# Altium schematic sheet SafeBox.SchDoc
size 381 x 241 mm
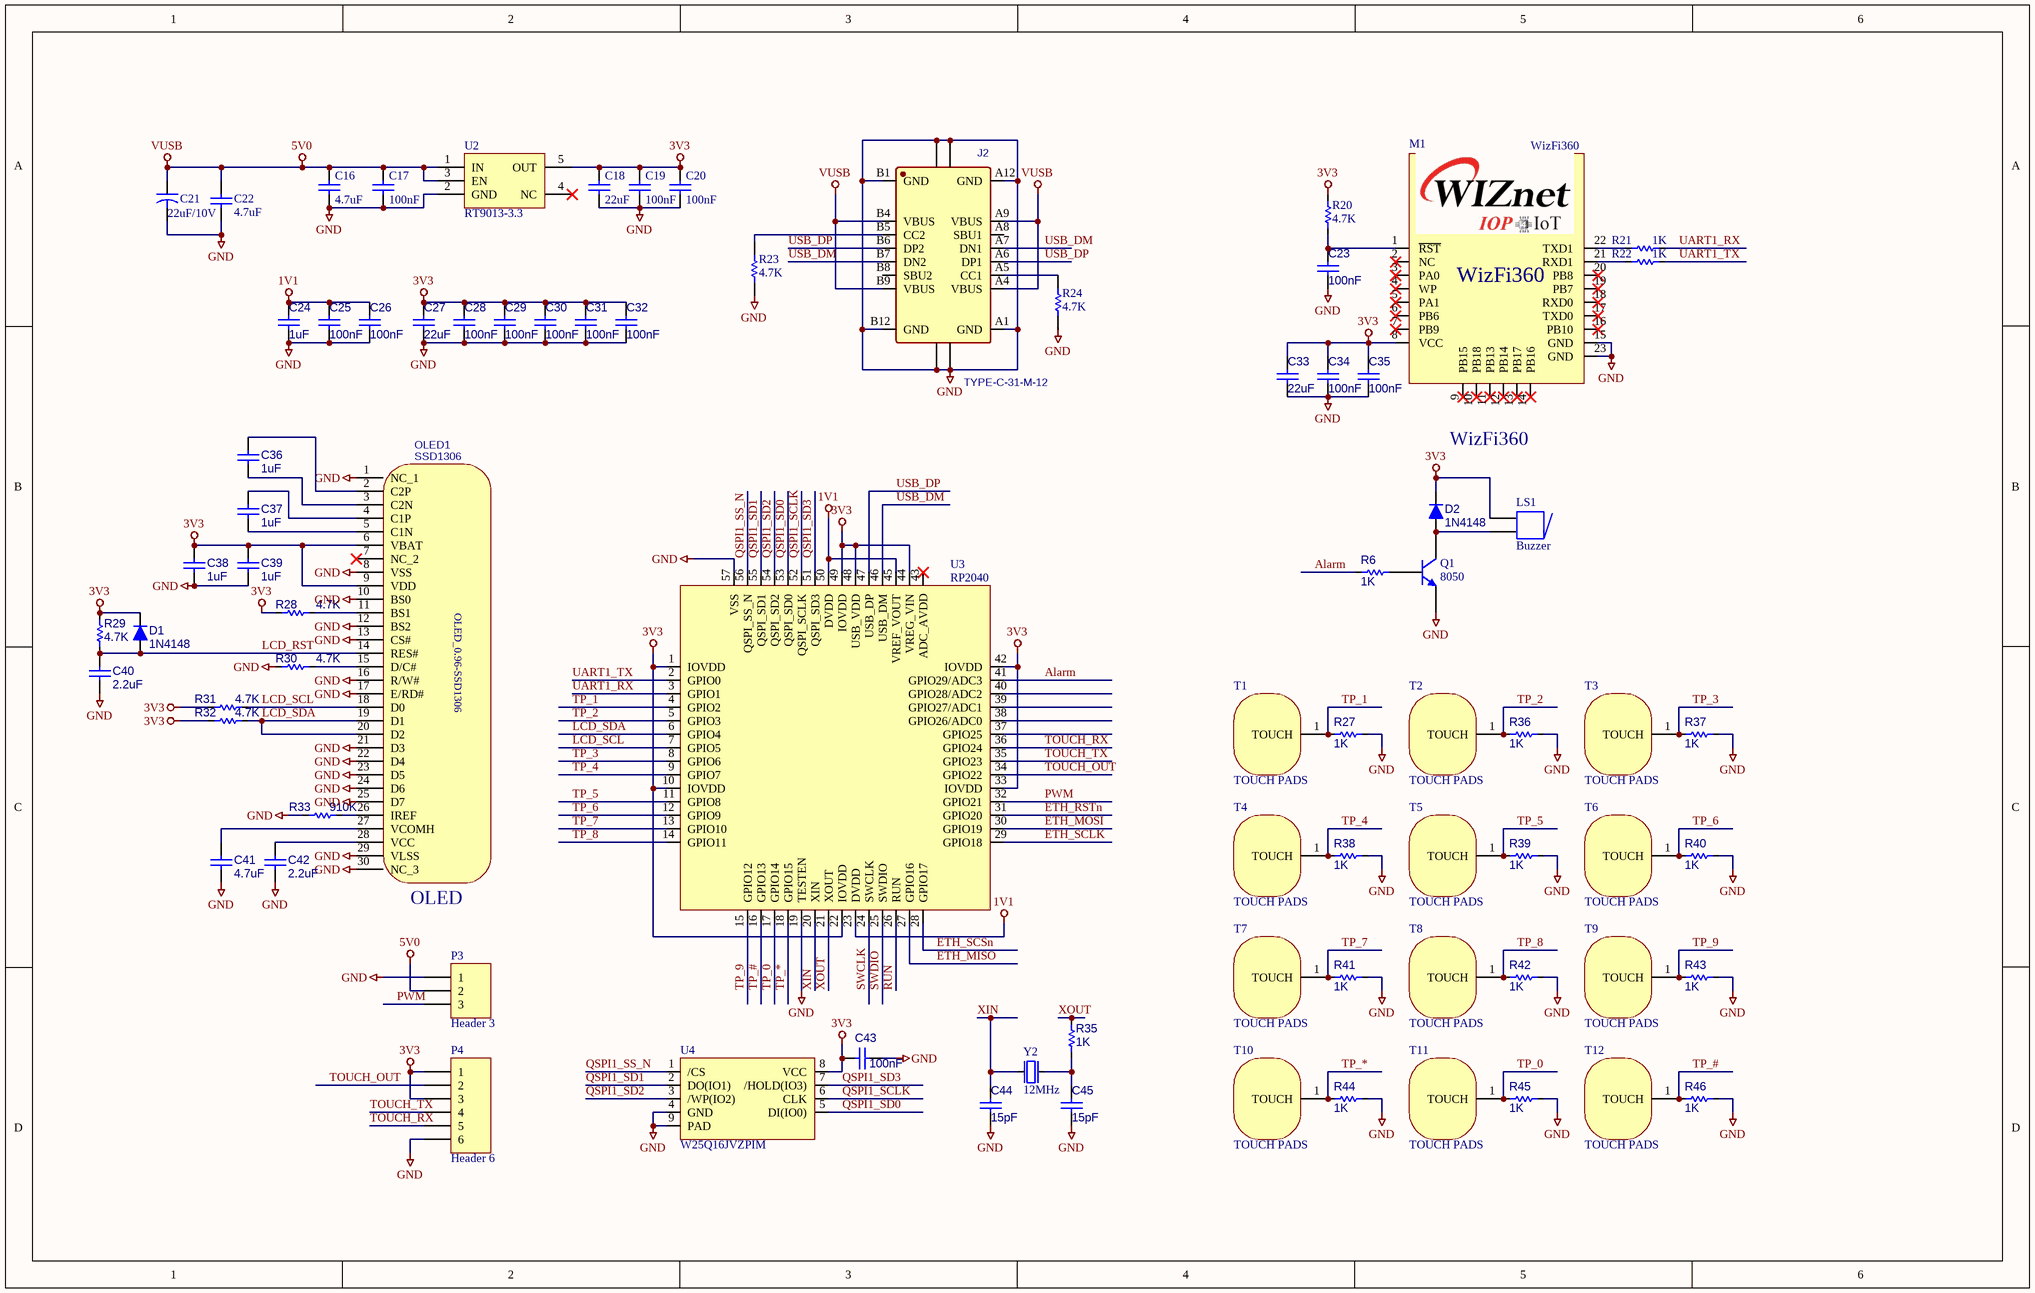
[diagram p0: SafeBox.SchDoc]

## Parts
C16  value 4.7uF  [0603-C]  (hidden comment: Cap)
C17  value 100nF  [0603-C]  (hidden comment: Cap)
C18  value 22uF  [0603-C]  (hidden comment: Cap)
C19  value 100nF  [0603-C]  (hidden comment: Cap)
C20  value 100nF  [0603-C]  (hidden comment: Cap)
C21  value 22uF/10V  [1206-C]  (hidden comment: Cap2)
C22  value 4.7uF  [1206-c]  (hidden comment: Cap)
C23  100nF  [0603-C]
C24  1uF  [0603-C]
C25  100nF  [0603-C]
C26  100nF  [0603-C]
C27  22uF  [0603-C]
C28  100nF  [0603-C]
C29  100nF  [0603-C]
C30  100nF  [0603-C]
C31  100nF  [0603-C]
C32  100nF  [0603-C]
C33  22uF  [0603-C]
C34  100nF  [0603-C]
C35  100nF  [0603-C]
C36  1uF  [0603-C]
C37  1uF  [0603-C]
C38  1uF  [0603-C]
C39  1uF  [0603-C]
C40  2.2uF  [0603-C]
C41  4.7uF  [0603-C]
C42  2.2uF  [0603-C]
C43  100nF  [0603-C]
C44  15pF  [0603-C]
C45  15pF  [0603-C]
D1  1N4148  [SOD-323(1-C,2-A)]
D2  1N4148  [SOD-323(1-C,2-A)]
J2  TYPE-C-31-M-12  [USB-C_SMT-TYPE-C-31-M-12]
LS1  Buzzer  [Buzzer 5020 SMT]
M1  WizFi360  [WIZFI360-PA]
OLED1  SSD1306  [OLED1.3_SSD1306]
P3  Header 3  [HDR1X3]
P4  Header 6  [HDR1X6]
Q1  8050  [SOT-23-3]
R6  1K  [0603-R]
R20  4.7K  [0603-C]
R21  1K  [0603-C]
R22  1K  [0603-C]
R23  value 4.7K  [0603-R]  (hidden comment: Res1)
R24  value 4.7K  [0603-R]  (hidden comment: Res1)
R27  1K  [0603-R]
R28  4.7K  [0603-R]
R29  4.7K  [0603-R]
R30  4.7K  [0603-R]
R31  4.7K  [0603-R]
R32  4.7K  [0603-R]
R33  910K  [0603-R]
R35  1K  [0603-R]
R36  1K  [0603-R]
R37  1K  [0603-R]
R38  1K  [0603-R]
R39  1K  [0603-R]
R40  1K  [0603-R]
R41  1K  [0603-R]
R42  1K  [0603-R]
R43  1K  [0603-R]
R44  1K  [0603-R]
R45  1K  [0603-R]
R46  1K  [0603-R]
T1  TOUCH PADS  [Touch PADS]
T2  TOUCH PADS  [Touch PADS]
T3  TOUCH PADS  [Touch PADS]
T4  TOUCH PADS  [Touch PADS]
T5  TOUCH PADS  [Touch PADS]
T6  TOUCH PADS  [Touch PADS]
T7  TOUCH PADS  [Touch PADS]
T8  TOUCH PADS  [Touch PADS]
T9  TOUCH PADS  [Touch PADS]
T10  TOUCH PADS  [Touch PADS]
T11  TOUCH PADS  [Touch PADS]
T12  TOUCH PADS  [Touch PADS]
U2  RT9013-3.3  [SOT-23-5]
U3  RP2040  [QFN56(0.4/7X7)]
U4  W25Q16JVZPIM  [WSON8(6X5_1.27)]
Y2  12MHz  [OSC-TZ1067B]

## Nets
1V1: C24.2 C25.2 C26.2 U3.23(DVDD) U3.45(VREF_VOUT) U3.50(DVDD)
3V3: C18.2 C19.2 C20.2 C27.2 C28.2 C29.2 C30.2 C31.2 C32.2 C33.2 C34.2 C35.2 C38.1 C39.1 C43.2 D1.1(K) D2.1(K) LS1.2 M1.8(VCC) OLED1.6(VBAT) OLED1.9(VDD) P4.1 P4.3 R20.2 R28.1 R29.2 R31.1 R32.1 U2.5(OUT) U3.1(IOVDD) U3.10(IOVDD) U3.22(IOVDD) U3.33(IOVDD) U3.42(IOVDD) U3.44(VREG_VIN) U3.48(USB_VDD) U3.49(IOVDD) U4.8(VCC)
5V0: C16.2 C17.2 C21.1 C22.1 J2.A4(VBUS) J2.A9(VBUS) J2.B4(VBUS) J2.B9(VBUS) P3.2 U2.1(IN) U2.3(EN)  [also labelled VUSB]
GND: C16.1 C17.1 C18.1 C19.1 C20.1 C21.2 C22.2 C23.1 C24.1 C25.1 C26.1 C27.1 C28.1 C29.1 C30.1 C31.1 C32.1 C33.1 C34.1 C35.1 C38.2 C39.2 C40.2 C41.2 C42.2 C43.1 C44.2 C45.2 J2.1 J2.2 J2.3 J2.4 J2.A1(GND) J2.A12(GND) J2.B1(GND) J2.B12(GND) M1.15(GND) M1.23(GND) OLED1.1(NC_1) OLED1.8(VSS) OLED1.10(BS0) OLED1.12(BS2) OLED1.13(CS#) OLED1.16(R/W#) OLED1.17(E/RD#) OLED1.21(D3) OLED1.22(D4) OLED1.23(D5) OLED1.24(D6) OLED1.25(D7) OLED1.29(VLSS) OLED1.30(NC_3) P3.1 P4.6 Q1.2(E) R23.1 R24.1 R27.1 R30.2 R33.1 R36.1 R37.1 R38.1 R39.1 R40.1 R41.1 R42.1 R43.1 R44.1 R45.1 R46.1 U2.2(GND) U3.19(TESTEN) U3.57(VSS) U4.4(GND) U4.9(PAD) Y2.2 Y2.4
Alarm: R6.2 U3.41(GPIO29/ADC3)
ETH_MISO: U3.27(GPIO16)
ETH_MOSI: U3.30(GPIO19)
ETH_RSTn: U3.31(GPIO20)
ETH_SCLK: U3.29(GPIO18)
ETH_SCSn: U3.28(GPIO17)
LCD_RST: C40.1 D1.2(A) OLED1.14(RES#) R29.1
LCD_SCL: OLED1.18(D0) R31.2 U3.7(GPIO5)
LCD_SDA: OLED1.19(D1) OLED1.20(D2) R32.2 U3.6(GPIO4)
PWM: P3.3 U3.32(GPIO21)
QSPI1_SCLK: U3.52(QSPI_SCLK) U4.6(CLK)
QSPI1_SD0: U3.53(QSPI_SD0) U4.5(DI(IO0))
QSPI1_SD1: U3.55(QSPI_SD1) U4.2(DO(IO1))
QSPI1_SD2: U3.54(QSPI_SD2) U4.3(/WP(IO2))
QSPI1_SD3: U3.51(QSPI_SD3) U4.7(/HOLD(IO3))
QSPI1_SS_N: U3.56(QSPI_SS_N) U4.1(/CS)
RUN: U3.26(RUN)
SWCLK: U3.24(SWCLK)
SWDIO: U3.25(SWDIO)
TOUCH_OUT: P4.2 U3.34(GPIO22)
TOUCH_RX: P4.5 U3.36(GPIO24)
TOUCH_TX: P4.4 U3.35(GPIO23)
TP_0: R45.2 T11.1(TOUCH) U3.17(GPIO14)
TP_1: R27.2 T1.1(TOUCH) U3.4(GPIO2)
TP_2: R36.2 T2.1(TOUCH) U3.5(GPIO3)
TP_3: R37.2 T3.1(TOUCH) U3.8(GPIO6)
TP_4: R38.2 T4.1(TOUCH) U3.9(GPIO7)
TP_5: R39.2 T5.1(TOUCH) U3.11(GPIO8)
TP_6: R40.2 T6.1(TOUCH) U3.12(GPIO9)
TP_7: R41.2 T7.1(TOUCH) U3.13(GPIO10)
TP_8: R42.2 T8.1(TOUCH) U3.14(GPIO11)
TP_9: R43.2 T9.1(TOUCH) U3.15(GPIO12)
TP_#: R46.2 T12.1(TOUCH) U3.16(GPIO13)
TP_*: R44.2 T10.1(TOUCH) U3.18(GPIO15)
UART1_RX: R21.2 U3.3(GPIO1)
UART1_TX: R22.2 U3.2(GPIO0)
USB_DM: J2.A7(DN1) J2.B7(DN2) U3.46(USB_DM)
USB_DP: J2.A6(DP1) J2.B6(DP2) U3.47(USB_DP)
XIN: C44.1 U3.20(XIN) Y2.1(inp)
XOUT: R35.2 U3.21(XOUT)
NetC23_2: C23.2 M1.1(~{RST}) R20.1
NetC36_1: C36.1 OLED1.2(C2P)
NetC36_2: C36.2 OLED1.3(C2N)
NetC37_1: C37.1 OLED1.4(C1P)
NetC37_2: C37.2 OLED1.5(C1N)
NetC41_1: C41.1 OLED1.27(VCOMH)
NetC42_1: C42.1 OLED1.28(VCC)
NetC45_1: C45.1 R35.1 Y2.3(out)
NetD2_2: D2.2(A) LS1.1 Q1.3(C)
NetJ2_A5: J2.A5(CC1) R24.2
NetJ2_B5: J2.B5(CC2) R23.2
NetM1_21: M1.21(RXD1) R22.1
NetM1_22: M1.22(TXD1) R21.1
NetOLED1_11: OLED1.11(BS1) R28.2
NetOLED1_15: OLED1.15(D/C#) R30.1
NetOLED1_26: OLED1.26(IREF) R33.2
NetQ1_1: Q1.1(B) R6.1

Not connected (* = marked no-connect by the designer): J2 A8(SBU1) B8(SBU2); M1 2(NC)* 3(PA0)* 4(WP)* 5(PA1)* 6(PB6)* 7(PB9)* 9(PB15)* 10(PB18)* 11(PB13)* 12(PB14)* 13(PB17)* 14(PB16)* 16(PB10)* 17(TXD0)* 18(RXD0)* 19(PB7)* 20(PB8)*; OLED1 7(NC_2)*; U2 4(NC)*; U3 37(GPIO25) 38(GPIO26/ADC0) 39(GPIO27/ADC1) 40(GPIO28/ADC2) 43(ADC_AVDD)*

## Notes on the sheet
- WizFi360
- (near OLED1) OLED
- (in symbol SSD1306) OLED_0.96-SSD1306

## Library data of the parts
C16-C20 C22 = Cap: Capacitor; Published: 8-Jun-2000; LatestRevisionDate: 17-Jul-2002; LatestRevisionNote: Re-released for DXP Platform.; PackageReference: RAD-0.3; Publisher: Altium Limited
C21 = Cap2: Capacitor; Published: 23-Sep-2002; Publisher: Altium Limited
C23-C32 C34-C45 = CAP-0402: Ceramic CAP 0402(1005)
C33 = CAP-0805: Ceramic CAP 0805(2012)
D1 D2 = DIODE-BAT60A: Silicon Schottky Diode
J2 = TYPE-C-31-M-12: BOM_Manufacturer: Rectangular Connectors - Contacts; Contributor: LCSC; BOM_Supplier: LCSC; BOM_Supplier Part: C165948; BOM_Manufacturer Part: TYPE-C-31-M-12; spicePre: U; spiceSymbolName: TYPE-C-31-M-12
LS1 = Buzzer: Magnetic Transducer Buzzer; Published: 24-Mar-1999; LatestRevisionDate: 17-Dec-2003; LatestRevisionNote: Schematic revised, PCB Footprint replaced.; DatasheetVersion: 17-Dec-2003; PackageReference: ABSM-1574; Publisher: Altium Limited; PackageDescription: Magnetic Transducer Buzzer; ComponentLink1Description: Manufacturer Link; ComponentLink1URL: http://www.megastar.com/linecard/buzzmode/index.php
OLED1 = SSD1306: Contributor: xinghen; spicePre: U; spiceSymbolName: SSD1306
P3 = Header 3: Header, 3-Pin; LatestRevisionDate: 17-Jul-2002; LatestRevisionNote: Re-released for DXP Platform.; Publisher: Altium Limited
P4 = Header 6: Header, 6-Pin; LatestRevisionDate: 17-Jul-2002; LatestRevisionNote: Re-released for DXP Platform.; Publisher: Altium Limited
Q1 = NPN: NPN Bipolar Transistor; Published: 8-Jun-2000; LatestRevisionDate: 17-Jul-2002; LatestRevisionNote: Re-released for DXP Platform.; PackageReference: TO-226-AA; Publisher: Altium Limited; PackageDescription: TO, Flat Index; 3 In-Line, Axial Leads; Body Dia. 4.8mm; Leads 0.55 x 0.51 mm (max); Code_JEDEC: TO-226-AA
R6 R27-R33 R35-R46 = RES-0402: 0603-R
R20-R22 = RES-0402
R23 R24 = Res1: Resistor; Published: 8-Jun-2000; LatestRevisionDate: 17-Jul-2002; LatestRevisionNote: Re-released for DXP Platform.; PackageReference: AXIAL-0.3; Publisher: Altium Limited
U3 = RP2040: Raspverry Pi, Dual ARM Cortex-M0+ @ 133MHz
U4 = W25Q16JVZPIM: 3V 16M-BIT / SERIAL FLASH MEMORY WITH / DUAL/QUAD SPI, QPI & DTR
Y2 = OSC-TZ1067B-12MHz: X-tal 12MHz,3.2x2.5 SMD, CL=20pF